# Altium schematic sheet MAZ000141 - Diagrama físico.SchDoc: MAZ000141 - Diagrama físico
size A; ApprovedBy: Omar Ortega; CheckedBy: Omar Ortega; Author: Nahuel Martinez; CompanyName: Body Health; DrawnBy: Nahuel Martinez; Revision: A; SheetNumber: 2; SheetTotal: 2
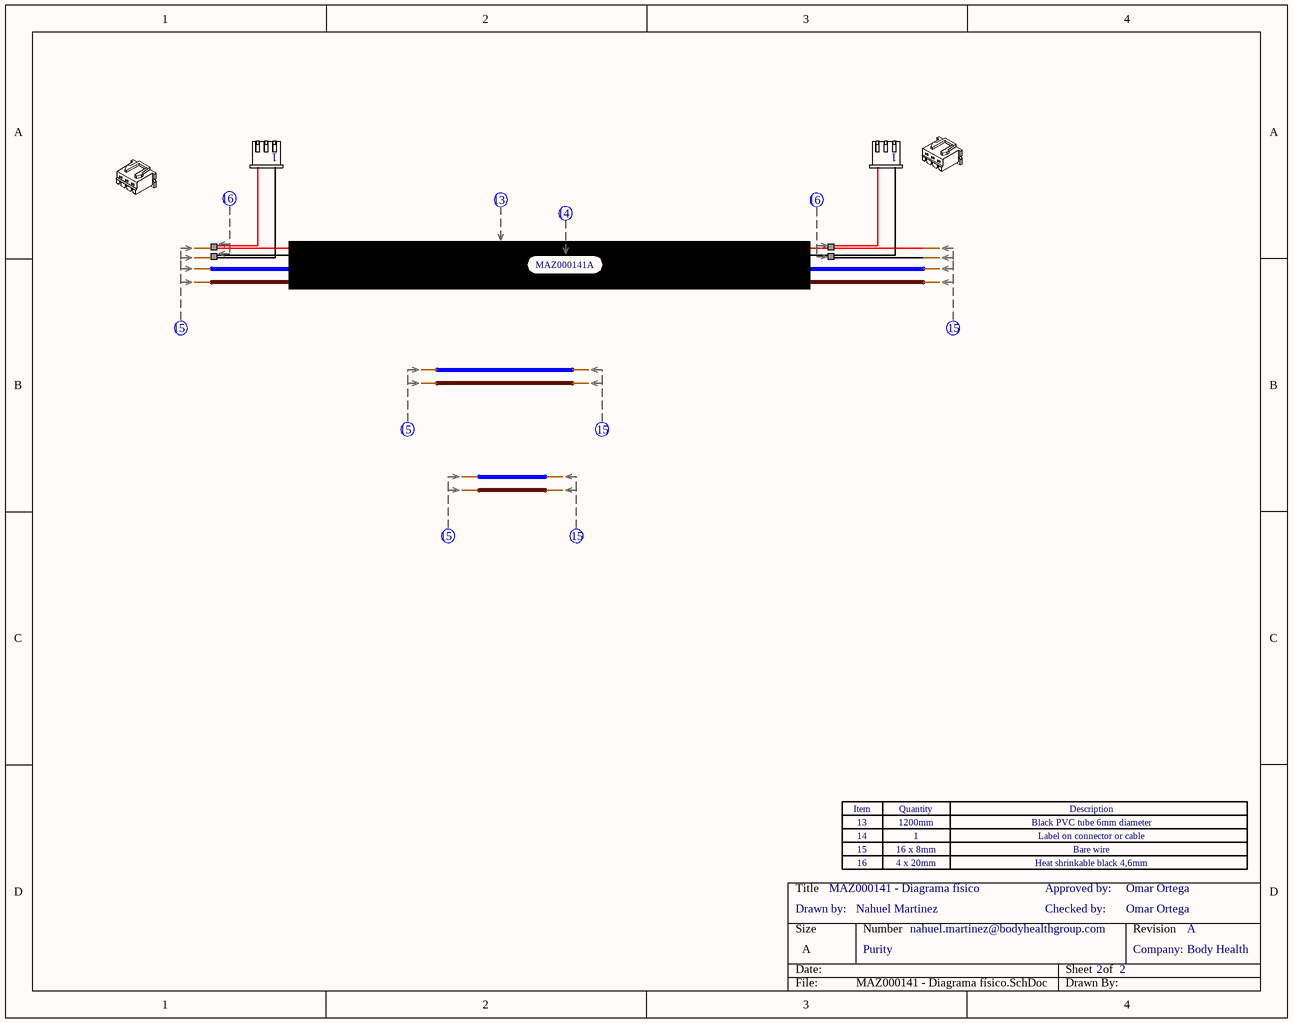
[diagram p0: MAZ000141 - Diagrama físico.SchDoc]

## Parts
(Parts that share a designator on the sheet are numbered #1, #2 ... from top to bottom, then left to right.)
Con?#1  XHP-3  (value not drawn)  (part A of 4)
Con?#2  XHP-3  (value not drawn)  (part A of 4)
Con?#3  XHP-3  (value not drawn)  (part B of 4)
Con?#4  XHP-3  (value not drawn)  (part B of 4)
Eti2  Etiqueta  (value not drawn)
Ter1  Termocontraible  (value not drawn)
Ter?#1  Termocontraible  (value not drawn)
Ter?#2  Termocontraible  (value not drawn)
Ter?#3  Termocontraible  (value not drawn)
Ter?#4  Termocontraible  (value not drawn)
Ter?#5  Termocontraible  (value not drawn)
Ter?#6  Termocontraible  (value not drawn)
Ter?#7  Termocontraible  (value not drawn)
Ter?#8  Termocontraible  (value not drawn)
Zoc1  Zócalo_Header  (value not drawn)
Zoc?#1  Zócalo_Item  (value not drawn)
Zoc?#2  Zócalo_Item  (value not drawn)
Zoc?#3  Zócalo_Item  (value not drawn)
Zoc?#4  Zócalo_Item  (value not drawn)

## Notes on the sheet
- MAZ000141A
- (near Zoc?#2) 14
- 13
- 1
- 1200mm
- Label on connector or cable
- Black PVC tube 6mm diameter
- (near Zoc?#4) Drawn by:
- (near Zoc?#4) 16
- (near Zoc?#3) 15
- 4 x 20mm
- 16 x 8mm
- Checked by:
- Approved by:
- Heat shrinkable black 4,6mm
- Bare wire
- Purity
- nahuel.martinez@bodyhealthgroup.com
- Company:
- (in symbol Zócalo_Header) Item; Quantity; Description

## Library data of the parts
Con?#1-Con?#4 = XHP-3: CONN HOUSING 2.5MM 3POS; Fabricante: JST Sales America Inc.; Cod.DigiKey: 455-2219-ND; Cod.Fabricante: XHP-3; ComponentLink1Description: Manufacturer Link; ComponentLink1URL: http://www.jst-mfg.com/product/pdf/eng/eXH.pdf; DIGIKEYx50: 0.06220; CallOut: *; DIGIKEYx100: NO
Eti2 = Etiqueta: CallOut: 14; Texto: *
Ter1 = Termocontraible: CallOut: 13; Largo: *; Diámetro: *
Ter?#1 Ter?#2 = Termocontraible: CallOut: 16; Largo: *; Diámetro: *
Ter?#3-Ter?#8 = Termocontraible: CallOut: 15; Largo: *; Diámetro: *
Zoc1 = Zócalo_Header: Header para el zócalo de referencias
Zoc?#1-Zoc?#4 = Zócalo_Item: Ítem para el zócalo de referencias; Desginator: *; Quantity: *; ItemDescription: *